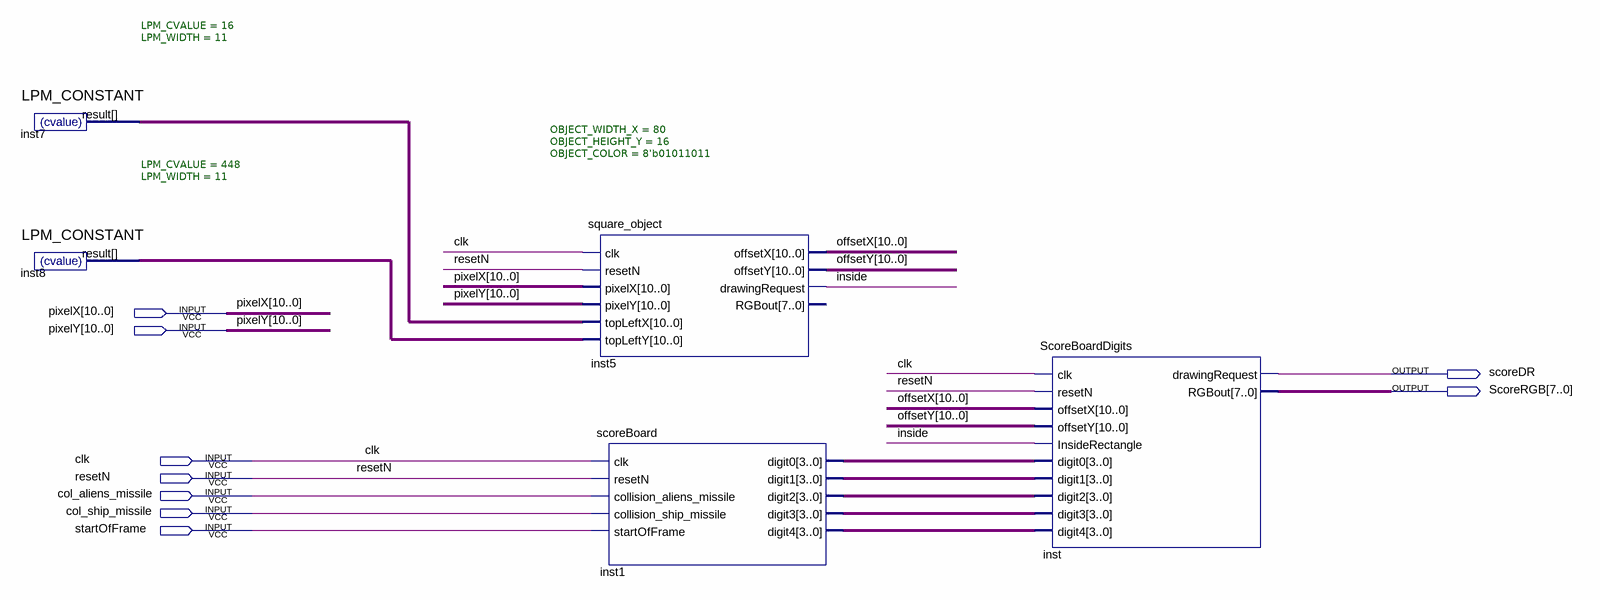
[diagram p0: schematic sheet]
// Quartus schematic score_Block_Digits.bdf as structural Verilog: 5 symbols, 9 pins
module score_Block_Digits (
  input  [10:0] pixelX,
  input  [10:0] pixelY,
  input  clk,
  input  resetN,
  input  col_aliens_missile,
  input  col_ship_missile,
  input  startOfFrame,
  output scoreDR,
  output [7:0] ScoreRGB
);

  wire \inside ;
  wire [3:0] inst1_digit0, inst1_digit1, inst1_digit2, inst1_digit3, inst1_digit4;
  wire [10:0] inst7_result, inst8_result, offsetX, offsetY;

  LPM_CONSTANT #(.LPM_CVALUE(16), .LPM_WIDTH(11)) inst7 (.result(inst7_result));
  LPM_CONSTANT #(.LPM_CVALUE(448), .LPM_WIDTH(11)) inst8 (.result(inst8_result));
  square_object #(.OBJECT_WIDTH_X(80), .OBJECT_HEIGHT_Y(16), .OBJECT_COLOR(8'b01011011)) inst5 (
    .clk(clk), .resetN(resetN), .pixelX(pixelX), .pixelY(pixelY), .topLeftX(inst7_result),
    .topLeftY(inst8_result), .offsetX(offsetX), .offsetY(offsetY), .drawingRequest(\inside ));  // open: RGBout
  scoreBoard inst1 (
    .clk(clk), .resetN(resetN), .collision_aliens_missile(col_aliens_missile),
    .collision_ship_missile(col_ship_missile), .startOfFrame(startOfFrame), .digit0(inst1_digit0),
    .digit1(inst1_digit1), .digit2(inst1_digit2), .digit3(inst1_digit3), .digit4(inst1_digit4));
  ScoreBoardDigits inst (
    .clk(clk), .resetN(resetN), .offsetX(offsetX), .offsetY(offsetY), .InsideRectangle(\inside ),
    .digit0(inst1_digit0), .digit1(inst1_digit1), .digit2(inst1_digit2), .digit3(inst1_digit3),
    .digit4(inst1_digit4), .drawingRequest(scoreDR), .RGBout(ScoreRGB));
endmodule
